# Altium schematic sheet FPGA_FLASH.SchDoc
size B; SheetNumber: 1; SheetTotal: 11
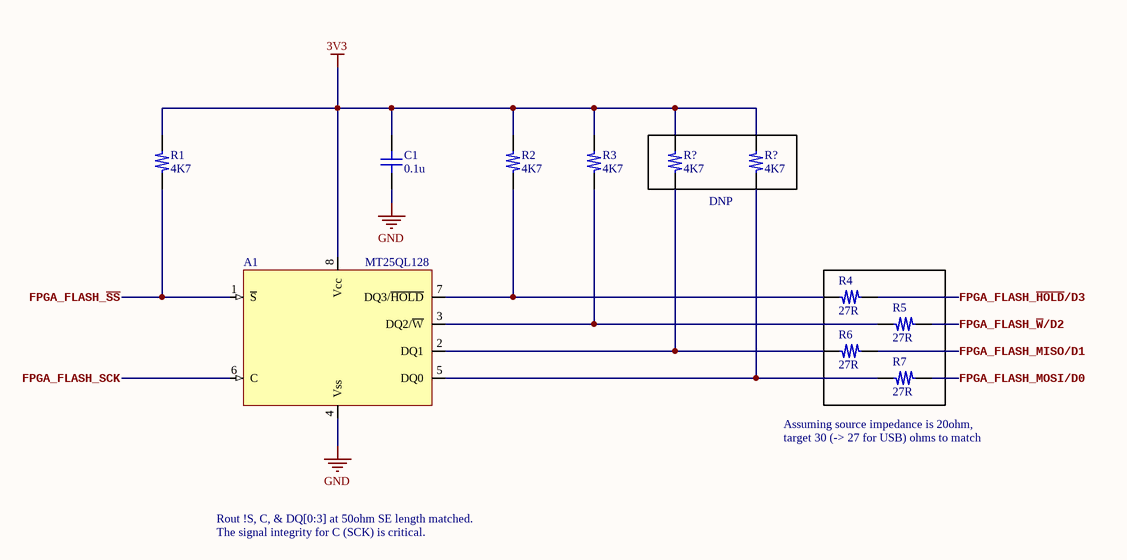
[diagram p0: FPGA_FLASH.SchDoc]

## Parts
(Parts that share a designator on the sheet are numbered #1, #2 ... from top to bottom, then left to right.)
A1  MT25QL128  [LOTES_ACA-SPI-004-K01]
C1  0.1u  [C_0402_Generic]
R1  4K7  [R_0402_Generic]
R2  4K7  [R_0402_Generic]
R3  4K7  [R_0402_Generic]
R4  27R  [R_0402_Generic]
R5  27R  [R_0402_Generic]
R6  27R  [R_0402_Generic]
R7  27R  [R_0402_Generic]
R?#1  4K7  [R_0402_Generic]
R?#2  4K7  [R_0402_Generic]

## Nets
3V3: A1.8(Vcc) C1.2 R1.2 R2.2 R3.2 R?#1.2 R?#2.2
GND: A1.4(Vss) C1.1
FPGA_FLASH_~{HOLD}/D3: R4.1
FPGA_FLASH_MISO/D1: R6.1
FPGA_FLASH_MOSI/D0: R7.1
FPGA_FLASH_~{SS}: A1.1(~{S}) R1.1
FPGA_FLASH_SCK: A1.6(C)
FPGA_FLASH_~{W}/D2: R5.1
NetA1_2: A1.2(DQ1) R6.2 R?#1.1
NetA1_3: A1.3(DQ2/~{W}) R3.1 R5.2
NetA1_5: A1.5(DQ0) R7.2 R?#2.1
NetA1_7: A1.7(DQ3/~{HOLD}) R2.1 R4.2

## Notes on the sheet
- (near R?#2) DNP
- (near R7) Assuming source impedance is 20ohm,
- target 30 (-> 27 for USB) ohms to match
- Rout !S, C, & DQ[0:3] at 50ohm SE length matched.
- The signal integrity for C (SCK) is critical.

## Library data of the parts
A1 = MT25QL128ABA1ESE_ACA-SPI-004: FLASH - NOR Memory IC 128Mbit SPI (Q)SPI 133 MHz 8-SO In ACA-SPI-004-K01 socket; Manufacturer: Micron Technology Inc; Manufacturer Part Number: MT25QL128ABA1ESE; Manufacturer2: LOTES; Manufacturer2 Part Number: ACA-SPI-004-K01
C1 = GRM155R71C104KA88D: 0.1µF 16V X7R SMD ceramic capacitor in 0402 size; Manufacturer: Murata Electronics; Manufacturer Part Number: GRM155R71C104KA88D
R1-R3 R?#1 R?#2 = ERJ-2RKF4701X: 4.7KOhm 1% 1/10W SMD resistor in 0402 size; Manufacturer: Panasonic; Manufacturer Part Number: ERJ-2RKF4701X
R4-R7 = ERJ-2RKF27R0X: 27Ohm 1% 1/10W SMD resistor in 0402 size; Manufacturer: Panasonic; Manufacturer Part Number: ERJ-2RKF27R0X